# Altium project BBB_Shield.PrjPcb
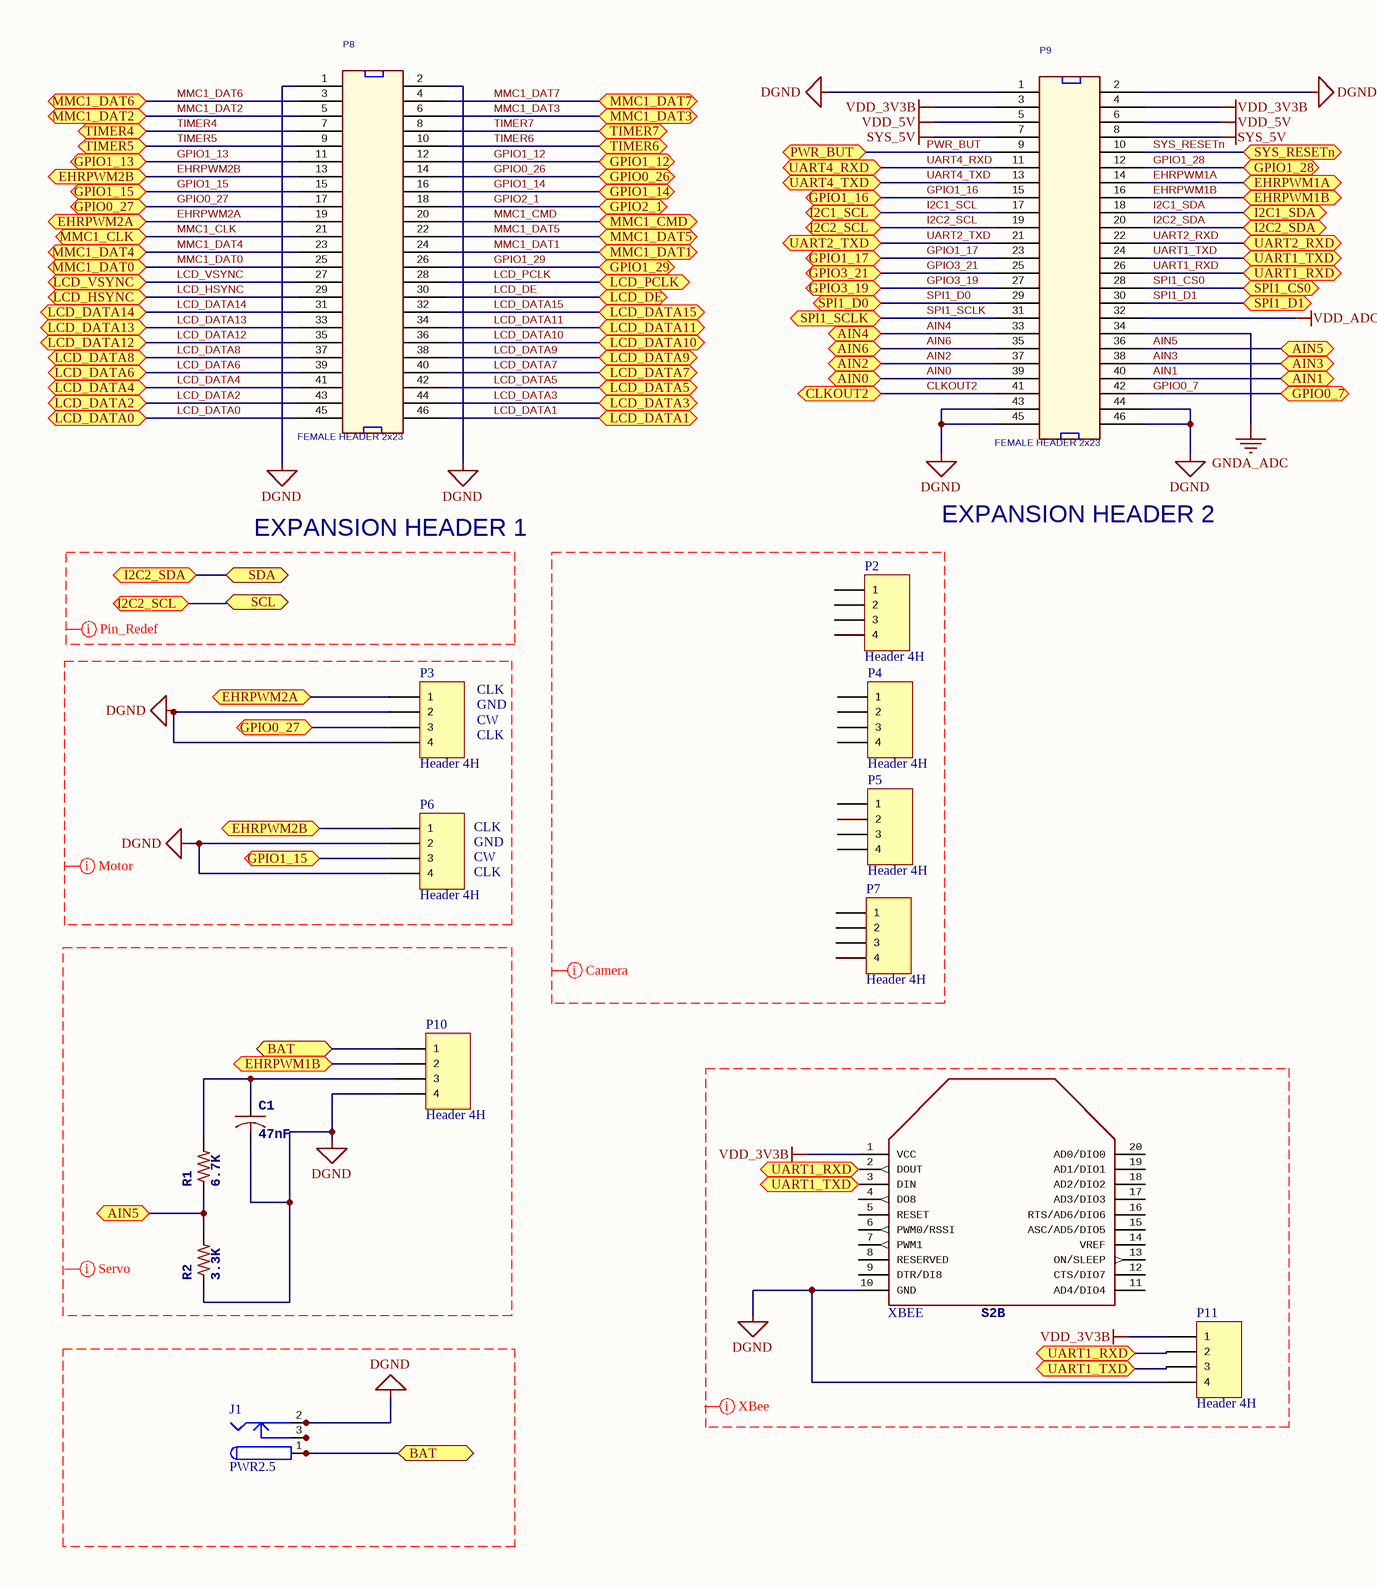
[diagram p0: BBB_Cape_template.SchDoc, left]
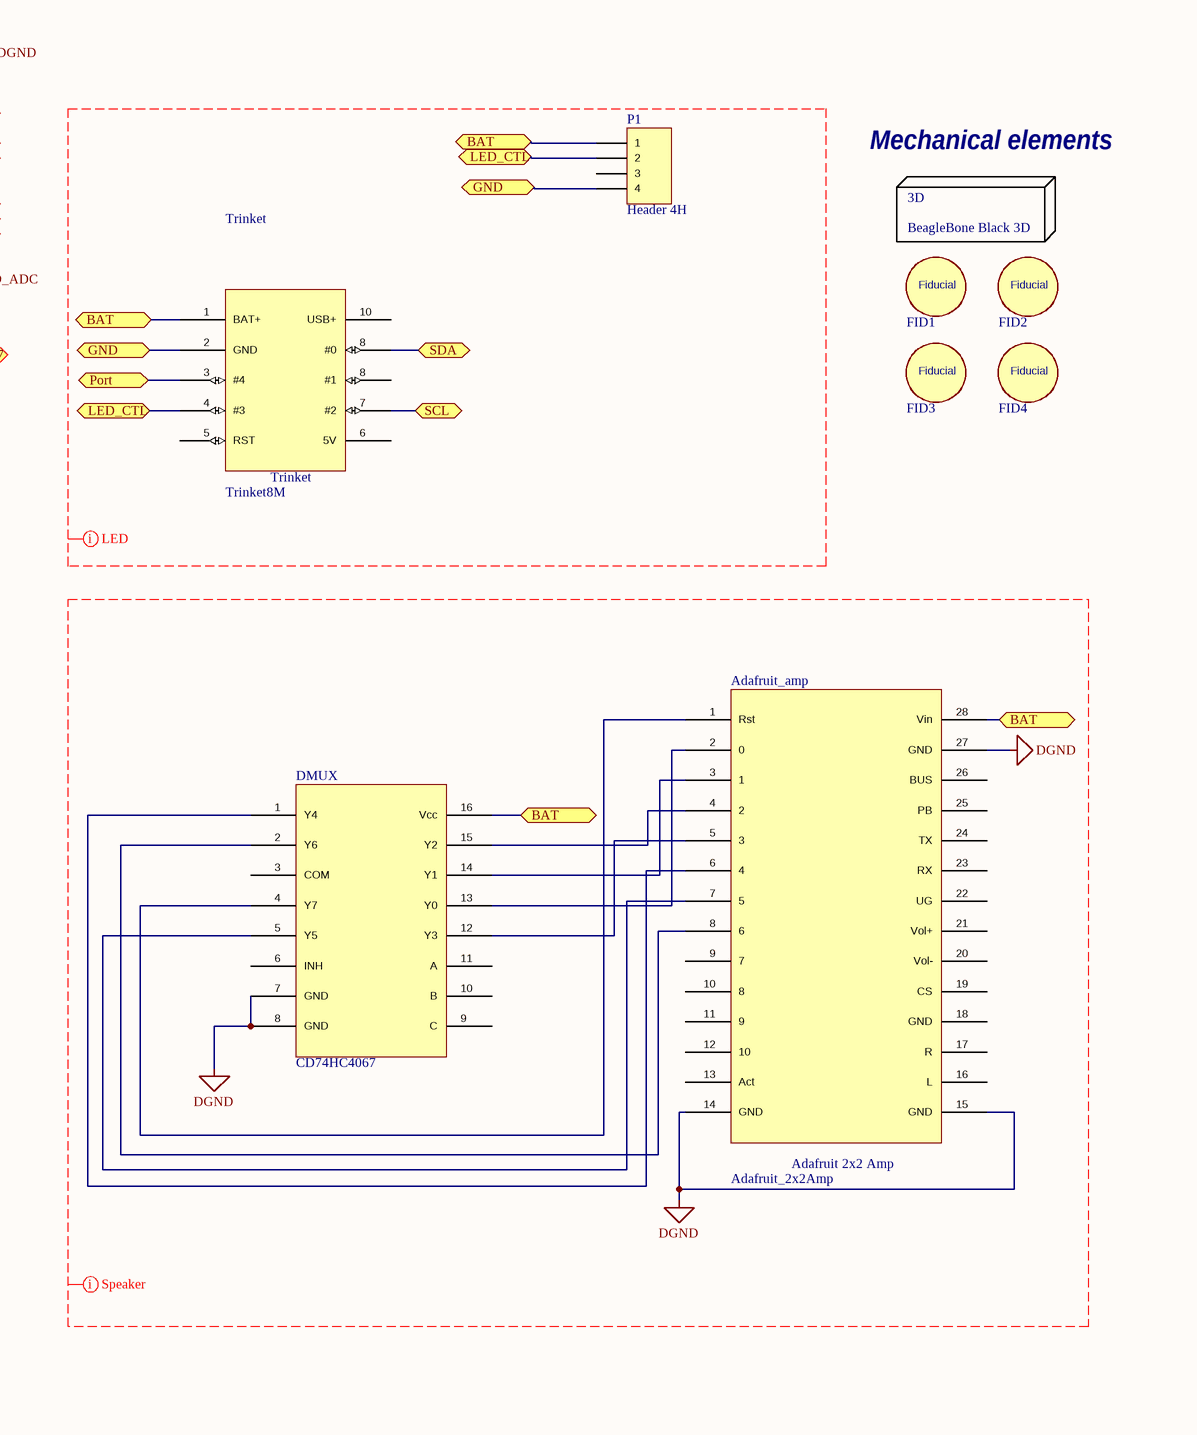
[diagram p1: BBB_Cape_template.SchDoc, right]
GlobalProjectLink: www.sasabremec.com; GlobalProjectName: Set in Project Options > Parameters > GlobalProjectName; GlobalProjectRevision: 1.0.1; GlobalProjectTeam: Prj Options > GlobalProjectName; GlobalRevisionDate: 2014-05-01
1 sheet, 24 parts. Net scope: flat (ports and power ports of the same name join across sheets).
Board files: BBB_Cape_2_Layer_template.PcbDoc, BBB_Cape_4_Layer_template.PcbDoc, withoutTemplate.PcbDoc

## Sheet BBB_Cape_template.SchDoc: Set in Document Options ?Parameters ?Title
size 439 x 289 mm; Author: Set in Document Options ?Parameters ?Author + Contact info

### Parts
3D  BeagleBone Black 3D
Adafruit_amp  Adafruit_2x2Amp  [adafruit_2x2w amp]
C1  47nF  [C0805]
DMUX  CD74HC4067  [so16]
FID1  MECH-Fiducial  [S_Fiducial]  (value not drawn)
FID2  MECH-Fiducial  [S_Fiducial]  (value not drawn)
FID3  MECH-Fiducial  [S_Fiducial]  (value not drawn)
FID4  MECH-Fiducial  [S_Fiducial]  (value not drawn)
J1  PWR2.5  [KLD-0202]
P1  Header 4H  [HDR1X4H]
P2  Header 4H  [HDR1X4H]
P3  Header 4H  [HDR1X4H]
P4  Header 4H  [HDR1X4H]
P5  Header 4H  [HDR1X4H]
P6  Header 4H  [HDR1X4H]
P7  Header 4H  [HDR1X4H]
P8  FEMALE HEADER 2x23  [HEADER23X2]
P9  FEMALE HEADER 2x23  [HEADER23X2]
P10  Header 4H  [HDR1X4H]
P11  Header 4H  [HDR1X4H]
R1  6.7K  [R0805]
R2  3.3K  [R0805]
S2B  XBEE  [XBEE]
Trinket  Trinket8M  [trinket]

### Ports
AIN0, AIN1, AIN2, AIN3, AIN4, AIN5, AIN6, BAT, CLKOUT2, EHRPWM1A, EHRPWM1B, EHRPWM2A, EHRPWM2B, GND, GPIO0_7, GPIO0_26, GPIO0_27, GPIO1_12, GPIO1_13, GPIO1_14, GPIO1_15, GPIO1_16, GPIO1_17, GPIO1_28, GPIO1_29, GPIO2_1, GPIO3_19, GPIO3_21, I2C1_SCL, I2C1_SDA, I2C2_SCL, I2C2_SDA, LCD_DATA0, LCD_DATA1, LCD_DATA2, LCD_DATA3, LCD_DATA4, LCD_DATA5, LCD_DATA6, LCD_DATA7, LCD_DATA8, LCD_DATA9, LCD_DATA10, LCD_DATA11, LCD_DATA12, LCD_DATA13, LCD_DATA14, LCD_DATA15, LCD_DE, LCD_HSYNC, LCD_PCLK, LCD_VSYNC, LED_CTL, MMC1_CLK, MMC1_CMD, MMC1_DAT0, MMC1_DAT1, MMC1_DAT2, MMC1_DAT3, MMC1_DAT4, MMC1_DAT5, MMC1_DAT6, MMC1_DAT7, Port, PWR_BUT, SCL, SDA, SPI1_CS0, SPI1_D0, SPI1_D1, SPI1_SCLK, SYS_RESETn, TIMER4, TIMER5, TIMER6, TIMER7, UART1_RXD, UART1_TXD, UART2_RXD, UART2_TXD, UART4_RXD, UART4_TXD

### Nets
DGND: Adafruit_amp.14(GND) Adafruit_amp.15(GND) Adafruit_amp.27(GND) C1.2 DMUX.7(GND) DMUX.8(GND) J1.2 J1.2A J1.2B P3.2 P3.4 P6.2 P6.4 P8.1 P8.2 P9.1 P9.2 P9.43 P9.44 P9.45 P9.46 P10.4 P11.4 R2.1 S2B.10(GND)
GNDA_ADC: P9.34
SYS_5V: P9.7 P9.8
VDD_3V3B: P9.3 P9.4 P11.1 S2B.1(VCC)
VDD_5V: P9.5 P9.6
VDD_ADC: P9.32
AIN0: P9.39 ; port AIN0
AIN1: P9.40 ; port AIN1
AIN2: P9.37 ; port AIN2
AIN3: P9.38 ; port AIN3
AIN4: P9.33 ; port AIN4
AIN5: P9.36 R1.1 R2.2 ; port AIN5
AIN6: P9.35 ; port AIN6
CLKOUT2: P9.41 ; port CLKOUT2
EHRPWM1A: P9.14 ; port EHRPWM1A
EHRPWM1B: P9.16 P10.2 ; port EHRPWM1B
EHRPWM2A: P3.1 P8.19 ; port EHRPWM2A
EHRPWM2B: P6.1 P8.13 ; port EHRPWM2B
GPIO0_7: P9.42 ; port GPIO0_7
GPIO0_26: P8.14 ; port GPIO0_26
GPIO0_27: P3.3 P8.17 ; port GPIO0_27
GPIO1_12: P8.12 ; port GPIO1_12
GPIO1_13: P8.11 ; port GPIO1_13
GPIO1_14: P8.16 ; port GPIO1_14
GPIO1_15: P6.3 P8.15 ; port GPIO1_15
GPIO1_16: P9.15 ; port GPIO1_16
GPIO1_17: P9.23 ; port GPIO1_17
GPIO1_28: P9.12 ; port GPIO1_28
GPIO1_29: P8.26 ; port GPIO1_29
GPIO2_1: P8.18 ; port GPIO2_1
GPIO3_19: P9.27 ; port GPIO3_19
GPIO3_21: P9.25 ; port GPIO3_21
I2C1_SCL: P9.17 ; port I2C1_SCL
I2C1_SDA: P9.18 ; port I2C1_SDA
I2C2_SCL: P9.19 Trinket.7(#2) ; port I2C2_SCL, port SCL
I2C2_SDA: P9.20 Trinket.8(#0) ; port I2C2_SDA, port SDA
LCD_DATA0: P8.45 ; port LCD_DATA0
LCD_DATA1: P8.46 ; port LCD_DATA1
LCD_DATA2: P8.43 ; port LCD_DATA2
LCD_DATA3: P8.44 ; port LCD_DATA3
LCD_DATA4: P8.41 ; port LCD_DATA4
LCD_DATA5: P8.42 ; port LCD_DATA5
LCD_DATA6: P8.39 ; port LCD_DATA6
LCD_DATA7: P8.40 ; port LCD_DATA7
LCD_DATA8: P8.37 ; port LCD_DATA8
LCD_DATA9: P8.38 ; port LCD_DATA9
LCD_DATA10: P8.36 ; port LCD_DATA10
LCD_DATA11: P8.34 ; port LCD_DATA11
LCD_DATA12: P8.35 ; port LCD_DATA12
LCD_DATA13: P8.33 ; port LCD_DATA13
LCD_DATA14: P8.31 ; port LCD_DATA14
LCD_DATA15: P8.32 ; port LCD_DATA15
LCD_DE: P8.30 ; port LCD_DE
LCD_HSYNC: P8.29 ; port LCD_HSYNC
LCD_PCLK: P8.28 ; port LCD_PCLK
LCD_VSYNC: P8.27 ; port LCD_VSYNC
MMC1_CLK: P8.21 ; port MMC1_CLK
MMC1_CMD: P8.20 ; port MMC1_CMD
MMC1_DAT0: P8.25 ; port MMC1_DAT0
MMC1_DAT1: P8.24 ; port MMC1_DAT1
MMC1_DAT2: P8.5 ; port MMC1_DAT2
MMC1_DAT3: P8.6 ; port MMC1_DAT3
MMC1_DAT4: P8.23 ; port MMC1_DAT4
MMC1_DAT5: P8.22 ; port MMC1_DAT5
MMC1_DAT6: P8.3 ; port MMC1_DAT6
MMC1_DAT7: P8.4 ; port MMC1_DAT7
PWR_BUT: P9.9 ; port PWR_BUT
SPI1_CS0: P9.28 ; port SPI1_CS0
SPI1_D0: P9.29 ; port SPI1_D0
SPI1_D1: P9.30 ; port SPI1_D1
SPI1_SCLK: P9.31 ; port SPI1_SCLK
SYS_RESETn: P9.10 ; port SYS_RESETn
TIMER4: P8.7 ; port TIMER4
TIMER5: P8.9 ; port TIMER5
TIMER6: P8.10 ; port TIMER6
TIMER7: P8.8 ; port TIMER7
UART1_RXD: P9.26 P11.2 S2B.2(DOUT) ; port UART1_RXD
UART1_TXD: P9.24 P11.3 S2B.3(DIN) ; port UART1_TXD
UART2_RXD: P9.22 ; port UART2_RXD
UART2_TXD: P9.21 ; port UART2_TXD
UART4_RXD: P9.11 ; port UART4_RXD
UART4_TXD: P9.13 ; port UART4_TXD
NetAdafruit_amp_1: Adafruit_amp.1(Rst) DMUX.4(Y7)
NetAdafruit_amp_2: Adafruit_amp.2(0) DMUX.13(Y0)
NetAdafruit_amp_3: Adafruit_amp.3(1) DMUX.14(Y1)
NetAdafruit_amp_4: Adafruit_amp.4(2) DMUX.15(Y2)
NetAdafruit_amp_5: Adafruit_amp.5(3) DMUX.12(Y3)
NetAdafruit_amp_6: Adafruit_amp.6(4) DMUX.1(Y4)
NetAdafruit_amp_7: Adafruit_amp.7(5) DMUX.5(Y5)
NetAdafruit_amp_8: Adafruit_amp.8(6) DMUX.2(Y6)
NetAdafruit_amp_28: Adafruit_amp.28(Vin) DMUX.16(Vcc) J1.1 J1.1A J1.1B P1.1 P10.1 Trinket.1(BAT+) ; port BAT
NetC1_1: C1.1 P10.3 R1.2
NetJ1_3: J1.3 J1.3A J1.3B
NetP1_2: P1.2 Trinket.4(#3) ; port LED_CTL
NetP1_4: P1.4 Trinket.2(GND) ; port GND
NetTrinket_3: Trinket.3(#4) ; port Port

Not connected (* = marked no-connect by the designer): Adafruit_amp 9(7) 10(8) 11(9) 12(10) 13(Act) 16(L) 17(R) 18(GND) 19(CS) 20(Vol-) 21(Vol+) 22(UG) 23(RX) 24(TX) 25(PB) 26(BUS); DMUX 3(COM) 6(INH) 9(C) 10(B) 11(A); P1 3; P2 1 2 3 4; P4 1 2 3 4; P5 1 2 3 4; P7 1 2 3 4; S2B 4(DO8) 5(RESET) 6(PWM0/RSSI) 7(PWM1) 8(RESERVED) 9(DTR/DI8) 11(AD4/DIO4) 12(CTS/DIO7) 13(ON/SLEEP) 14(VREF) 15(ASC/AD5/DIO5) 16(RTS/AD6/DIO6) 17(AD3/DIO3) 18(AD2/DIO2) 19(AD1/DIO1) 20(AD0/DIO0); Trinket 5(RST) 6(5V) 10(USB+)

### Layout directives
net class Motor: DGND
net class Servo: DGND
net class Camera: (no net found under the mark)
net class Xbee: DGND, VDD_3V3B
net class LED: (no net found under the mark)
net class Speaker: DGND
net class Pin_Redef: (no net found under the mark)

### Notes on the sheet
- (near 3D) Mechanical elements
- EXPANSION HEADER 1
- EXPANSION HEADER 2
- (near P3) CLK
- (near P3) GND
- (near P3) CW
- (near P6) CLK
- (near P6) GND
- (near P6) CW
- Unauthorized distribution, transmission or publication is strictly prohibited
- HISTORY REVISION
- REV.
- BRIEF DESCRIPTION
- DATE
- APPROVED
- DSGN:
- TOLERANCES:
- CHK:
- LINEAR                        +- 0,26
- TITLE:
- ALL DIMENSIONS ARE IN (mm)
- ANGULAR                     +- 0,5?
- SIZE:
- REV:
- Time:
- Date:
- DO NOT SCALE DROWING
- SCALE: 1:1
- DRAWING NO.:
- Sheet:
- of
- (in symbol Adafruit_2x2Amp) Adafruit 2x2 Amp

### Library data of the parts
C1 = C-USC0805
FID1-FID4 = MECH-Fiducial: Fiducial
J1 = PWR2.5: Low Voltage Power Supply Connector; Published: 17-Dec-2003; DatasheetDocument: 09-May-2002; Publisher: Altium Limited; ComponentLink1Description: Manufacturer Link; ComponentLink1URL: http://domino.kycon.com/internet/Products.html
P1-P7 P10 P11 = Header 4H: Header, 4-Pin, Right Angle; LatestRevisionDate: 17-Jul-2002; LatestRevisionNote: Re-released for DXP Platform.; Publisher: Altium Limited
P8 P9 = HDR_46_F_2_0.1_0.1: CONN HEADER FMAL 46PS.1" DL GOLD; Manufacturer: Sullins Connector Solutions; Manufacturer Part Number: PPPC232LFBN-RC; Number of Positions: 46; Number of Positions Loaded: All; Pitch: 0.100" (2.54mm); Supplier 1: Digi-Key; Supplier Part Number 1: S7126-ND; RoHS: RoHS Compliant; Category: Connectors, Interconnects; Stock 1: 750; Pricing 1: 1=2.75, 10=2.325, 25=2.2196, 50=2.0084, 100=1.7969, 250=1.58552, 500=1.4798, 1000=1.3741, 2500=1.32125 (USD); Connector Type: Header; Contact Type: Female Socket; Number of Rows: 2; Row Spacing: 0.100" (2.54mm); Mounting Type: Through Hole; Termination: Solder; Fastening Type: -; Features: -; Contact Finish: Gold; Contact Finish Thickness: Flash; Color: Black; Packaging: Bulk; ComponentLink1URL: http://www.sullinscorp.com/drawings/78_P(N)PxCxxxLFBN-RC,_10492-G.pdf; ComponentLink1Description: http://www.sullinscorp.com/drawings/78_P(N)PxCxxxLFBN-RC,_10492-G.pdf
R1 R2 = R-US_R0805

## Assembly variants
4L Variant of BBB_Cape_template: all parts fitted